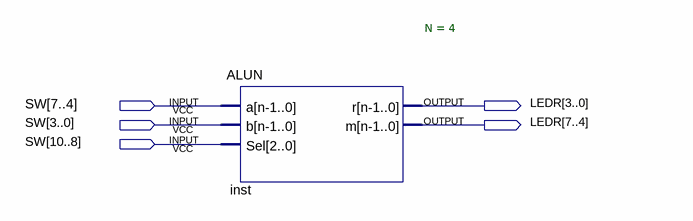
[diagram p0: schematic sheet]
// Quartus schematic ALUDemo.bdf as structural Verilog: 1 symbols, 5 pins
module ALUDemo (
  input  [10:0] SW,
  output [7:0] LEDR
);

  ALUN #(.N(4)) inst (.a(SW[7:4]), .b(SW[3:0]), .Sel(SW[10:8]), .r(LEDR[3:0]), .m(LEDR[7:4]));
endmodule
